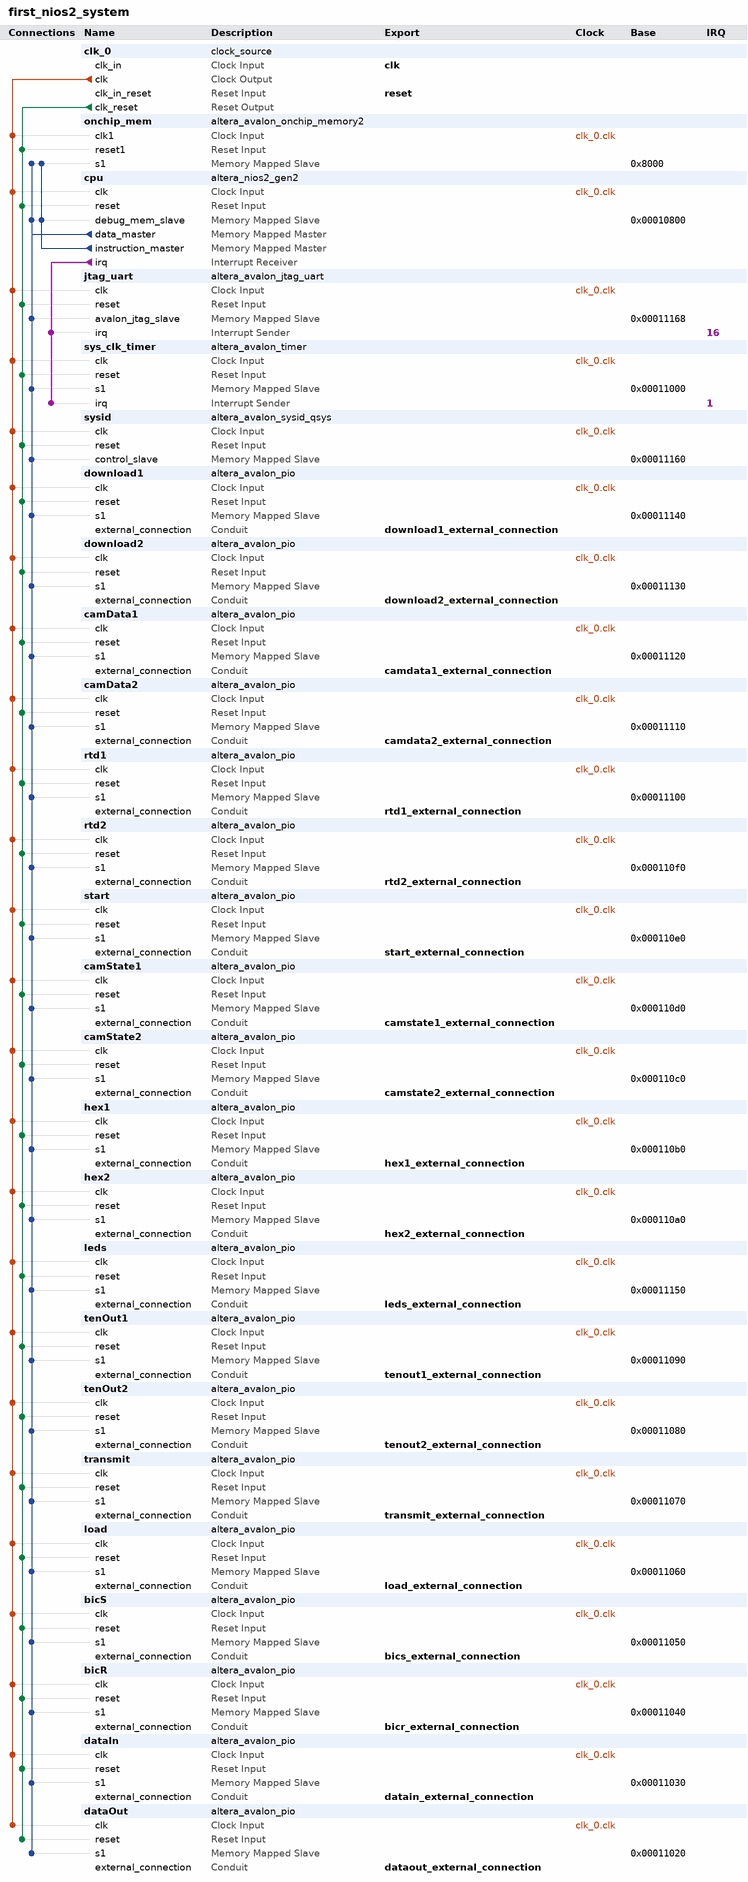
[diagram p0: system contents]
# Platform Designer (Qsys) system first_nios2_system, Cyclone V 5CSEMA5F31C6
# Parameters at their usual value, and those the tool derives, are not listed.
package require -exact qsys 17.0
create_system first_nios2_system
set_project_property DEVICE_FAMILY {Cyclone V}
set_project_property DEVICE 5CSEMA5F31C6

add_instance clk_0 clock_source 17.0
set_instance_parameter_value clk_0 clockFrequency 50000000

add_instance onchip_mem altera_avalon_onchip_memory2 17.0
set_instance_parameter_value onchip_mem dataWidth 32
set_instance_parameter_value onchip_mem dualPort false
set_instance_parameter_value onchip_mem initMemContent true
set_instance_parameter_value onchip_mem initializationFileName onchip_mem.hex
set_instance_parameter_value onchip_mem memorySize 20480

add_instance cpu altera_nios2_gen2 17.0
set_instance_parameter_value cpu dcache_size 0
set_instance_parameter_value cpu exceptionSlave onchip_mem.s1
set_instance_parameter_value cpu icache_size 2048
set_instance_parameter_value cpu impl Fast
set_instance_parameter_value cpu resetSlave onchip_mem.s1
set_instance_parameter_value cpu setting_activateTrace true

add_instance jtag_uart altera_avalon_jtag_uart 17.0
set_instance_parameter_value jtag_uart simInteractiveOptions NO_INTERACTIVE_WINDOWS

add_instance sys_clk_timer altera_avalon_timer 17.0
set_instance_parameter_value sys_clk_timer period 1
set_instance_parameter_value sys_clk_timer periodUnits MSEC

add_instance sysid altera_avalon_sysid_qsys 17.0
set_instance_parameter_value sysid id 0

add_instance download1 altera_avalon_pio 17.0
set_instance_parameter_value download1 direction Output
set_instance_parameter_value download1 width 1

add_instance download2 altera_avalon_pio 17.0
set_instance_parameter_value download2 direction Output
set_instance_parameter_value download2 width 1

add_instance camData1 altera_avalon_pio 17.0
set_instance_parameter_value camData1 direction Input
set_instance_parameter_value camData1 width 7

add_instance camData2 altera_avalon_pio 17.0
set_instance_parameter_value camData2 direction Input
set_instance_parameter_value camData2 width 7

add_instance rtd1 altera_avalon_pio 17.0
set_instance_parameter_value rtd1 direction Input
set_instance_parameter_value rtd1 width 1

add_instance rtd2 altera_avalon_pio 17.0
set_instance_parameter_value rtd2 direction Input
set_instance_parameter_value rtd2 width 1

add_instance start altera_avalon_pio 17.0
set_instance_parameter_value start direction Output
set_instance_parameter_value start width 1

add_instance camState1 altera_avalon_pio 17.0
set_instance_parameter_value camState1 direction Input
set_instance_parameter_value camState1 width 6

add_instance camState2 altera_avalon_pio 17.0
set_instance_parameter_value camState2 direction Input
set_instance_parameter_value camState2 width 6

add_instance hex1 altera_avalon_pio 17.0
set_instance_parameter_value hex1 direction Output
set_instance_parameter_value hex1 width 7

add_instance hex2 altera_avalon_pio 17.0
set_instance_parameter_value hex2 direction Output
set_instance_parameter_value hex2 width 7

add_instance leds altera_avalon_pio 17.0
set_instance_parameter_value leds direction Output
set_instance_parameter_value leds width 8

add_instance tenOut1 altera_avalon_pio 17.0
set_instance_parameter_value tenOut1 direction Input
set_instance_parameter_value tenOut1 width 4

add_instance tenOut2 altera_avalon_pio 17.0
set_instance_parameter_value tenOut2 direction Input
set_instance_parameter_value tenOut2 width 4

add_instance transmit altera_avalon_pio 17.0
set_instance_parameter_value transmit direction Output
set_instance_parameter_value transmit width 1

add_instance load altera_avalon_pio 17.0
set_instance_parameter_value load direction Output
set_instance_parameter_value load width 1

add_instance bicS altera_avalon_pio 17.0
set_instance_parameter_value bicS direction Input
set_instance_parameter_value bicS width 4

add_instance bicR altera_avalon_pio 17.0
set_instance_parameter_value bicR direction Input
set_instance_parameter_value bicR width 4

add_instance dataIn altera_avalon_pio 17.0
set_instance_parameter_value dataIn direction Input
set_instance_parameter_value dataIn width 8

add_instance dataOut altera_avalon_pio 17.0
set_instance_parameter_value dataOut direction Output
set_instance_parameter_value dataOut width 8

# connections
add_connection clk_0.clk bicR.clk clock
add_connection clk_0.clk bicS.clk clock
add_connection clk_0.clk camData1.clk clock
add_connection clk_0.clk camData2.clk clock
add_connection clk_0.clk camState1.clk clock
add_connection clk_0.clk camState2.clk clock
add_connection clk_0.clk cpu.clk clock
add_connection clk_0.clk dataIn.clk clock
add_connection clk_0.clk dataOut.clk clock
add_connection clk_0.clk download1.clk clock
add_connection clk_0.clk download2.clk clock
add_connection clk_0.clk hex1.clk clock
add_connection clk_0.clk hex2.clk clock
add_connection clk_0.clk jtag_uart.clk clock
add_connection clk_0.clk leds.clk clock
add_connection clk_0.clk load.clk clock
add_connection clk_0.clk onchip_mem.clk1 clock
add_connection clk_0.clk rtd1.clk clock
add_connection clk_0.clk rtd2.clk clock
add_connection clk_0.clk start.clk clock
add_connection clk_0.clk sys_clk_timer.clk clock
add_connection clk_0.clk sysid.clk clock
add_connection clk_0.clk tenOut1.clk clock
add_connection clk_0.clk tenOut2.clk clock
add_connection clk_0.clk transmit.clk clock
add_connection clk_0.clk_reset bicR.reset reset
add_connection clk_0.clk_reset bicS.reset reset
add_connection clk_0.clk_reset camData1.reset reset
add_connection clk_0.clk_reset camData2.reset reset
add_connection clk_0.clk_reset camState1.reset reset
add_connection clk_0.clk_reset camState2.reset reset
add_connection clk_0.clk_reset cpu.reset reset
add_connection clk_0.clk_reset dataIn.reset reset
add_connection clk_0.clk_reset dataOut.reset reset
add_connection clk_0.clk_reset download1.reset reset
add_connection clk_0.clk_reset download2.reset reset
add_connection clk_0.clk_reset hex1.reset reset
add_connection clk_0.clk_reset hex2.reset reset
add_connection clk_0.clk_reset jtag_uart.reset reset
add_connection clk_0.clk_reset leds.reset reset
add_connection clk_0.clk_reset load.reset reset
add_connection clk_0.clk_reset onchip_mem.reset1 reset
add_connection clk_0.clk_reset rtd1.reset reset
add_connection clk_0.clk_reset rtd2.reset reset
add_connection clk_0.clk_reset start.reset reset
add_connection clk_0.clk_reset sys_clk_timer.reset reset
add_connection clk_0.clk_reset sysid.reset reset
add_connection clk_0.clk_reset tenOut1.reset reset
add_connection clk_0.clk_reset tenOut2.reset reset
add_connection clk_0.clk_reset transmit.reset reset
add_connection cpu.data_master bicR.s1 avalon
set_connection_parameter_value cpu.data_master/bicR.s1 baseAddress 0x00011040
add_connection cpu.data_master bicS.s1 avalon
set_connection_parameter_value cpu.data_master/bicS.s1 baseAddress 0x00011050
add_connection cpu.data_master camData1.s1 avalon
set_connection_parameter_value cpu.data_master/camData1.s1 baseAddress 0x00011120
add_connection cpu.data_master camData2.s1 avalon
set_connection_parameter_value cpu.data_master/camData2.s1 baseAddress 0x00011110
add_connection cpu.data_master camState1.s1 avalon
set_connection_parameter_value cpu.data_master/camState1.s1 baseAddress 0x000110d0
add_connection cpu.data_master camState2.s1 avalon
set_connection_parameter_value cpu.data_master/camState2.s1 baseAddress 0x000110c0
add_connection cpu.data_master cpu.debug_mem_slave avalon
set_connection_parameter_value cpu.data_master/cpu.debug_mem_slave baseAddress 0x00010800
add_connection cpu.data_master dataIn.s1 avalon
set_connection_parameter_value cpu.data_master/dataIn.s1 baseAddress 0x00011030
add_connection cpu.data_master dataOut.s1 avalon
set_connection_parameter_value cpu.data_master/dataOut.s1 baseAddress 0x00011020
add_connection cpu.data_master download1.s1 avalon
set_connection_parameter_value cpu.data_master/download1.s1 baseAddress 0x00011140
add_connection cpu.data_master download2.s1 avalon
set_connection_parameter_value cpu.data_master/download2.s1 baseAddress 0x00011130
add_connection cpu.data_master hex1.s1 avalon
set_connection_parameter_value cpu.data_master/hex1.s1 baseAddress 0x000110b0
add_connection cpu.data_master hex2.s1 avalon
set_connection_parameter_value cpu.data_master/hex2.s1 baseAddress 0x000110a0
add_connection cpu.data_master jtag_uart.avalon_jtag_slave avalon
set_connection_parameter_value cpu.data_master/jtag_uart.avalon_jtag_slave baseAddress 0x00011168
add_connection cpu.data_master leds.s1 avalon
set_connection_parameter_value cpu.data_master/leds.s1 baseAddress 0x00011150
add_connection cpu.data_master load.s1 avalon
set_connection_parameter_value cpu.data_master/load.s1 baseAddress 0x00011060
add_connection cpu.data_master onchip_mem.s1 avalon
set_connection_parameter_value cpu.data_master/onchip_mem.s1 baseAddress 0x8000
add_connection cpu.data_master rtd1.s1 avalon
set_connection_parameter_value cpu.data_master/rtd1.s1 baseAddress 0x00011100
add_connection cpu.data_master rtd2.s1 avalon
set_connection_parameter_value cpu.data_master/rtd2.s1 baseAddress 0x000110f0
add_connection cpu.data_master start.s1 avalon
set_connection_parameter_value cpu.data_master/start.s1 baseAddress 0x000110e0
add_connection cpu.data_master sys_clk_timer.s1 avalon
set_connection_parameter_value cpu.data_master/sys_clk_timer.s1 baseAddress 0x00011000
add_connection cpu.data_master sysid.control_slave avalon
set_connection_parameter_value cpu.data_master/sysid.control_slave baseAddress 0x00011160
add_connection cpu.data_master tenOut1.s1 avalon
set_connection_parameter_value cpu.data_master/tenOut1.s1 baseAddress 0x00011090
add_connection cpu.data_master tenOut2.s1 avalon
set_connection_parameter_value cpu.data_master/tenOut2.s1 baseAddress 0x00011080
add_connection cpu.data_master transmit.s1 avalon
set_connection_parameter_value cpu.data_master/transmit.s1 baseAddress 0x00011070
add_connection cpu.instruction_master cpu.debug_mem_slave avalon
set_connection_parameter_value cpu.instruction_master/cpu.debug_mem_slave baseAddress 0x00010800
add_connection cpu.instruction_master onchip_mem.s1 avalon
set_connection_parameter_value cpu.instruction_master/onchip_mem.s1 baseAddress 0x8000
add_connection cpu.irq jtag_uart.irq interrupt
set_connection_parameter_value cpu.irq/jtag_uart.irq irqNumber 16
add_connection cpu.irq sys_clk_timer.irq interrupt
set_connection_parameter_value cpu.irq/sys_clk_timer.irq irqNumber 1

# exported interfaces
add_interface bicr_external_connection conduit end
set_interface_property bicr_external_connection EXPORT_OF bicR.external_connection
add_interface bics_external_connection conduit end
set_interface_property bics_external_connection EXPORT_OF bicS.external_connection
add_interface camdata1_external_connection conduit end
set_interface_property camdata1_external_connection EXPORT_OF camData1.external_connection
add_interface camdata2_external_connection conduit end
set_interface_property camdata2_external_connection EXPORT_OF camData2.external_connection
add_interface camstate1_external_connection conduit end
set_interface_property camstate1_external_connection EXPORT_OF camState1.external_connection
add_interface camstate2_external_connection conduit end
set_interface_property camstate2_external_connection EXPORT_OF camState2.external_connection
add_interface clk clock sink
set_interface_property clk EXPORT_OF clk_0.clk_in
add_interface datain_external_connection conduit end
set_interface_property datain_external_connection EXPORT_OF dataIn.external_connection
add_interface dataout_external_connection conduit end
set_interface_property dataout_external_connection EXPORT_OF dataOut.external_connection
add_interface download1_external_connection conduit end
set_interface_property download1_external_connection EXPORT_OF download1.external_connection
add_interface download2_external_connection conduit end
set_interface_property download2_external_connection EXPORT_OF download2.external_connection
add_interface hex1_external_connection conduit end
set_interface_property hex1_external_connection EXPORT_OF hex1.external_connection
add_interface hex2_external_connection conduit end
set_interface_property hex2_external_connection EXPORT_OF hex2.external_connection
add_interface leds_external_connection conduit end
set_interface_property leds_external_connection EXPORT_OF leds.external_connection
add_interface load_external_connection conduit end
set_interface_property load_external_connection EXPORT_OF load.external_connection
add_interface reset reset sink
set_interface_property reset EXPORT_OF clk_0.clk_in_reset
add_interface rtd1_external_connection conduit end
set_interface_property rtd1_external_connection EXPORT_OF rtd1.external_connection
add_interface rtd2_external_connection conduit end
set_interface_property rtd2_external_connection EXPORT_OF rtd2.external_connection
add_interface start_external_connection conduit end
set_interface_property start_external_connection EXPORT_OF start.external_connection
add_interface tenout1_external_connection conduit end
set_interface_property tenout1_external_connection EXPORT_OF tenOut1.external_connection
add_interface tenout2_external_connection conduit end
set_interface_property tenout2_external_connection EXPORT_OF tenOut2.external_connection
add_interface transmit_external_connection conduit end
set_interface_property transmit_external_connection EXPORT_OF transmit.external_connection

set_interconnect_requirement {$system} qsys_mm.clockCrossingAdapter HANDSHAKE
set_interconnect_requirement {$system} qsys_mm.insertDefaultSlave FALSE
set_interconnect_requirement {$system} qsys_mm.maxAdditionalLatency 1

save_system first_nios2_system.qsys
